# Altium schematic sheet MAIN_SCHE.SchDoc
size A; SheetNumber: 1; SheetTotal: 3
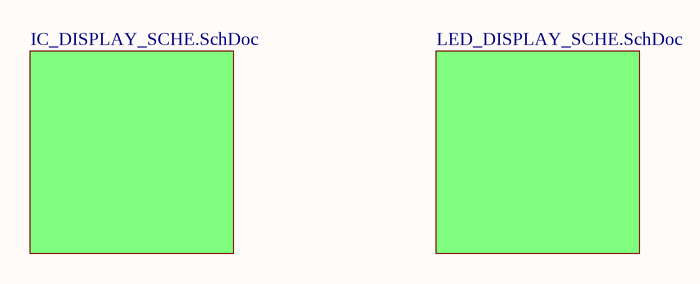
[diagram p0: MAIN_SCHE.SchDoc]

## Sub-sheets
Designator = LED_DISPLAY_SCHE.SchDoc: no entries
IC_DISPLAY_SCHE.SchDoc = IC_DISPLAY_SCHE.SchDoc: no entries